# Altium schematic sheet Sensores.SchDoc
size A4; Date: 09 July 2012; Author: Simon Markham; DrawnBy: Simon Markham; Engineer: Simon Markham; Organization: Markham Designs
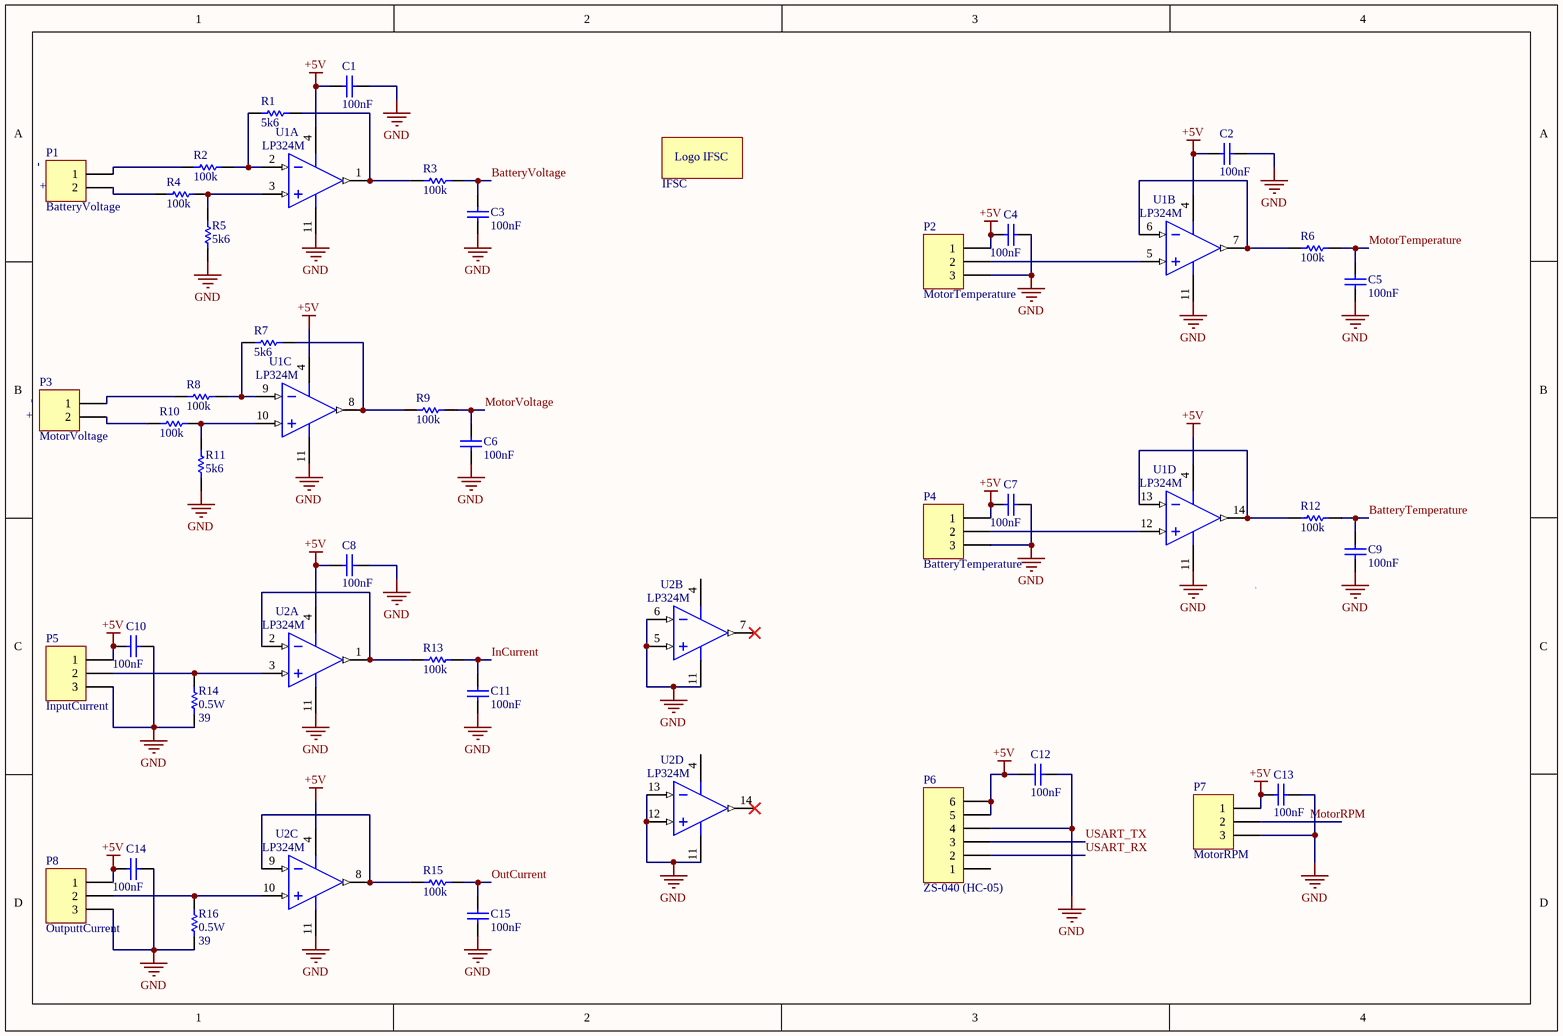
[diagram p0: Sensores.SchDoc]

## Parts
C1  value 100nF  [0805C]  (hidden comment: 0805)
C2  value 100nF  [0805C]  (hidden comment: 0805)
C3  value 100nF  [0805C]  (hidden comment: 0805)
C4  value 100nF  [0805C]  (hidden comment: 0805)
C5  value 100nF  [0805C]  (hidden comment: 0805)
C6  value 100nF  [0805C]  (hidden comment: 0805)
C7  value 100nF  [0805C]  (hidden comment: 0805)
C8  value 100nF  [0805C]  (hidden comment: 0805)
C9  value 100nF  [0805C]  (hidden comment: 0805)
C10  value 100nF  [0805C]  (hidden comment: 0805)
C11  value 100nF  [0805C]  (hidden comment: 0805)
C12  value 100nF  [0805C]  (hidden comment: 0805)
C13  value 100nF  [0805C]  (hidden comment: 0805)
C14  value 100nF  [0805C]  (hidden comment: 0805)
C15  value 100nF  [0805C]  (hidden comment: 0805)
P1  BatteryVoltage  [KRE_2]
P2  MotorTemperature  [KRE_3]
P3  MotorVoltage  [KRE_2]
P4  BatteryTemperature  [KRE_3]
P5  InputCurrent  [KRE_3]
P6  ZS-040 (HC-05)  [Header 6x1 8.5mm]
P7  MotorRPM  [KRE_3]
P8  OutputtCurrent  [KRE_3]
R1  value 5k6  [0805R]  (hidden comment: Res1)
R2  value 100k  [0805R]  (hidden comment: Res1)
R3  value 100k  [0805R]  (hidden comment: Res1)
R4  value 100k  [0805R]  (hidden comment: Res1)
R5  value 5k6  [0805R]  (hidden comment: Res1)
R6  value 100k  [0805R]  (hidden comment: Res1)
R7  value 5k6  [0805R]  (hidden comment: Res1)
R8  value 100k  [0805R]  (hidden comment: Res1)
R9  value 100k  [0805R]  (hidden comment: Res1)
R10  value 100k  [0805R]  (hidden comment: Res1)
R11  value 5k6  [0805R]  (hidden comment: Res1)
R12  value 100k  [0805R]  (hidden comment: Res1)
R13  value 100k  [0805R]  (hidden comment: Res1)
R14  0.5W  value 39  [R700-4.0mm]
R15  value 100k  [0805R]  (hidden comment: Res1)
R16  0.5W  value 39  [R700-4.0mm]
U1  LP324M  [SOIC14-150(50)]  (parts A,B,C,D of 4)
U2  LP324M  [SOIC14-150(50)]  (parts A,B,C,D of 4)
X?  IFSC  [IFSC_SILK]

## Nets
+5V: C1.1 C2.1 C4.1 C7.1 C8.1 C10.1 C12.1 C13.1 C14.1 P2.1 P4.1 P5.1 P6.5 P6.6 P7.1 P8.1 U1.4(V+) U2.4(V+)
GND: C1.2 C2.2 C3.1 C4.2 C5.1 C6.1 C7.2 C8.2 C9.1 C10.2 C11.1 C12.2 C13.2 C14.2 C15.1 P2.3 P4.3 P5.3 P6.4 P7.3 P8.3 R5.1 R11.2 R14.1 R16.1 U1.11(GND) U2.5(IN2+) U2.6(IN2-) U2.11(GND) U2.12(IN4+) U2.13(IN4-)
BatteryTemperature: C9.2 R12.2
BatteryVoltage: C3.2 R3.2
InCurrent: C11.2 R13.2
MotorRPM: P7.2
MotorTemperature: C5.2 R6.2
MotorVoltage: C6.2 R9.2
OutCurrent: C15.2 R15.2
USART_RX: P6.2
USART_TX: P6.3
NetP1_1: P1.1 R2.1
NetP1_2: P1.2 R4.1
NetP2_2: P2.2 U1.5(IN2+)
NetP3_1: P3.1 R8.1
NetP3_2: P3.2 R10.1
NetP4_2: P4.2 U1.12(IN4+)
NetP5_2: P5.2 R14.2 U2.3(IN1+)
NetP8_2: P8.2 R16.2 U2.10(IN3+)
NetR1_1: R1.1 R2.2 U1.2(IN1-)
NetR1_2: R1.2 R3.1 U1.1(OUT1)
NetR4_2: R4.2 R5.2 U1.3(IN1+)
NetR6_1: R6.1 U1.6(IN2-) U1.7(OUT2)
NetR7_1: R7.1 R8.2 U1.9(IN3-)
NetR7_2: R7.2 R9.1 U1.8(OUT3)
NetR10_2: R10.2 R11.1 U1.10(IN3+)
NetR12_1: R12.1 U1.13(IN4-) U1.14(OUT4)
NetR13_1: R13.1 U2.1(OUT1) U2.2(IN1-)
NetR15_1: R15.1 U2.8(OUT3) U2.9(IN3-)

Not connected (* = marked no-connect by the designer): P6 1; U2 7(OUT2)* 14(OUT4)*

## Notes on the sheet
- (near P1) -
- (near P1) +
- (near P3) +
- (near P3) -
- (in symbol IFSC) Logo IFSC

## Library data of the parts
C1-C15 = Cap: Capacitor
P1 P3 = KRE_2: Terminal Block 1x2
P2 P4 P5 P7 P8 = KRE_3: Terminal Block 1x3
P6 = KRE_6: Terminal Block 1x6
R1-R16 = Res1: Resistor
U1 U2 = LP324M: Micropower Quad Operational Amplifier; Manufacturer: National Semiconductor; CompType: Amplifiers; PackageTopMarking: NSUZXYTT*LP324M; PowerWise: N; Published: 4-Dec-2008; DatasheetVersion: Jul-2001; PackageVersion: revJ, Jan-1996; PackageReference: M14A; Publisher: Altium Limited; PackageDescription: Molded Package S.O., .150in Wide, 14 Lead; PartNumber: LP324M; RoHS: O; PinCount: 14; DigiKeyPartNumber: LP324MXCT-ND; Code_JEDEC: MS-012AB; Code_IPC: SOIC127P600-14; ComponentLink1Description: LP324 Datasheet; ComponentLink1URL: http://www.national.com/ds/LP/LP324.pdf; ComponentLink2Description: LP324 Web Page; ComponentLink2URL: http://www.national.com/pf/LP/LP324.html; ComponentLink3Description: M14A Package Page; ComponentLink3URL: http://www.national.com/packaging/folders/m14a.html
X? = IFSC: Logomarca IFSC